# EAGLE design USBRALite14a (EAGLE 6.6.0)
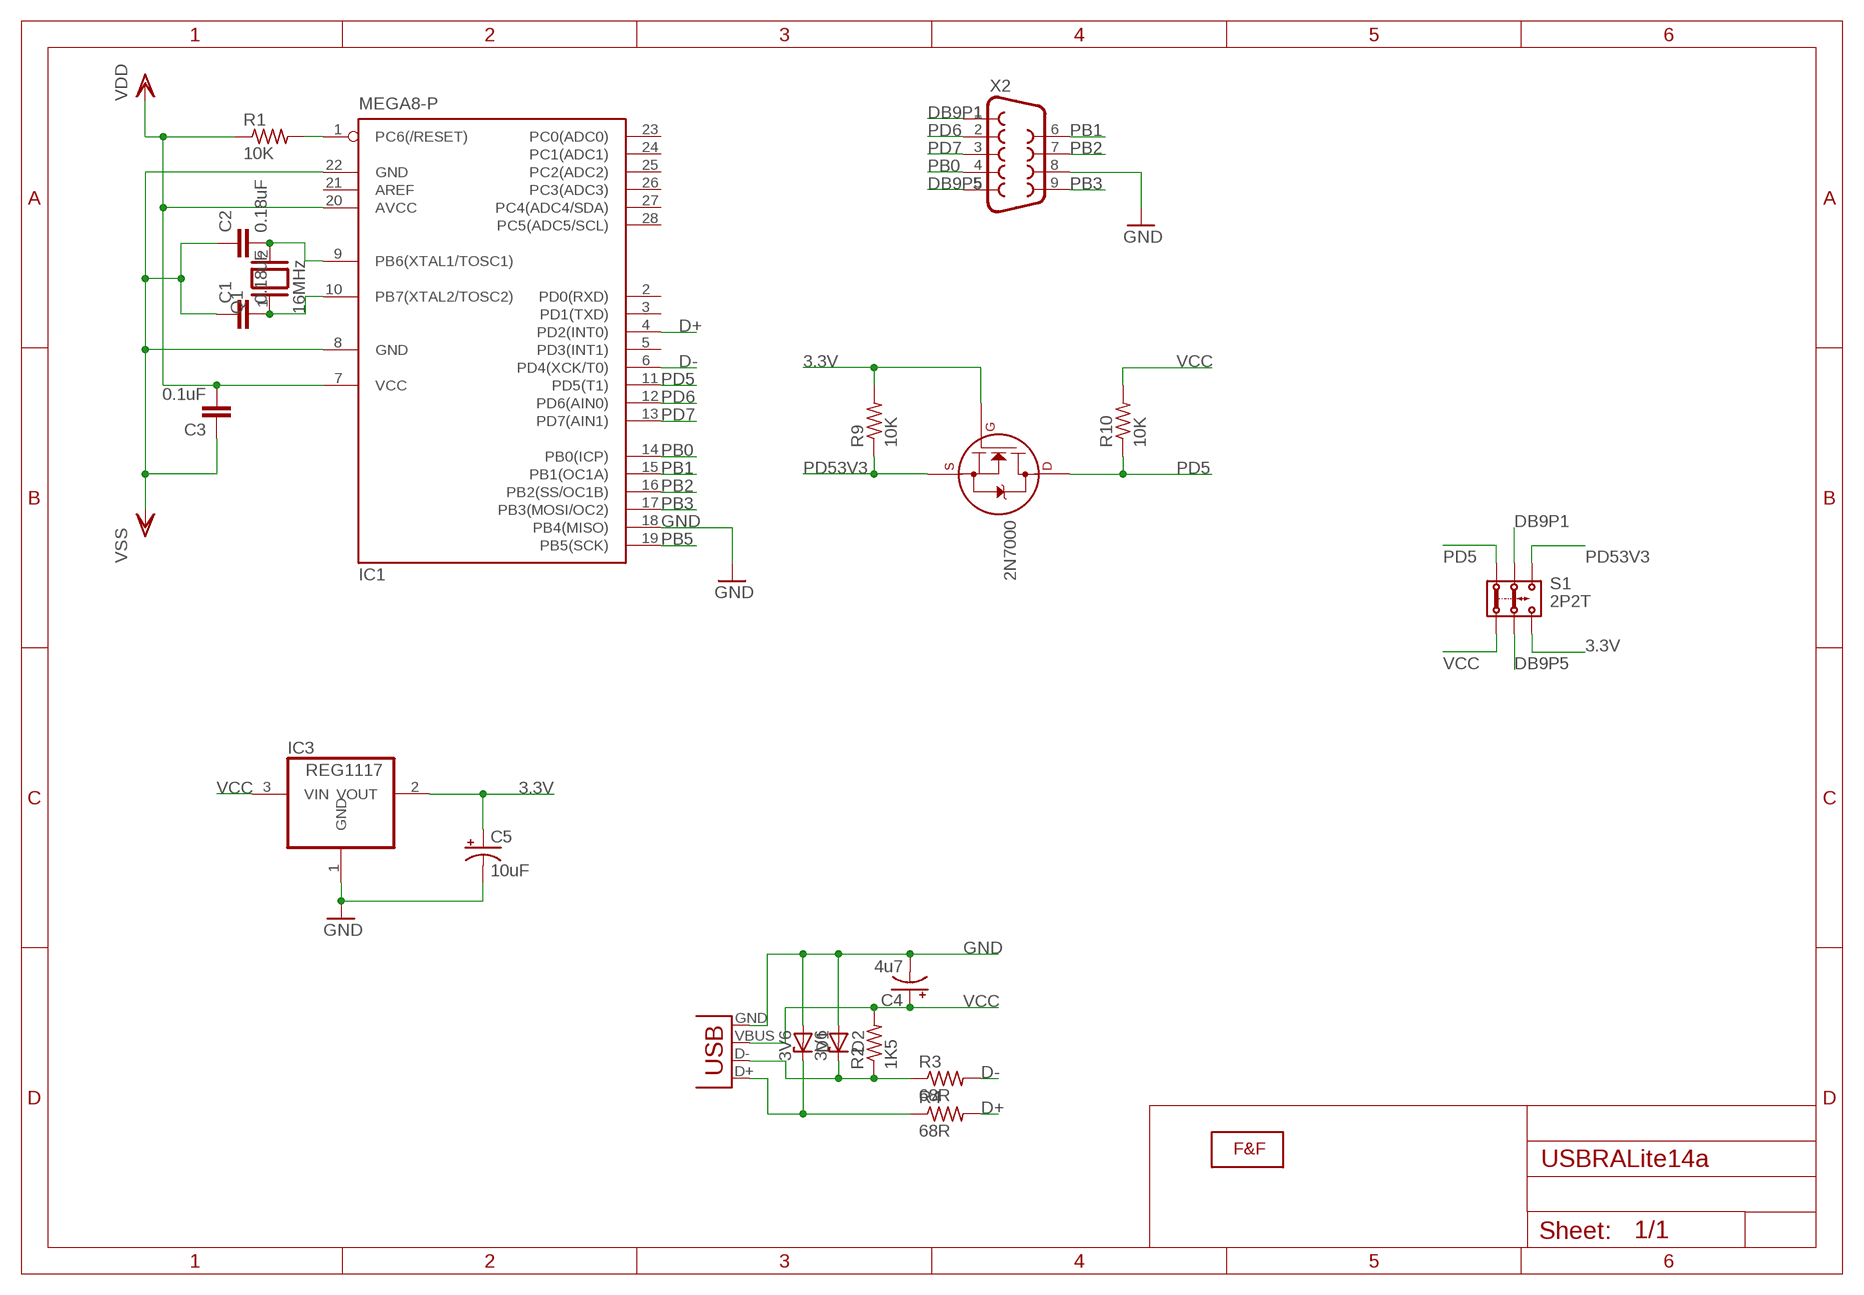
[diagram p0: schematic, sheet 1]

## Parts
2N7000  2N7000_TO92  [TO-92]
C1  0.18uF  C-EU050-024X044  [C050-024X044]
C2  0.18uF  C-EU050-024X044  [C050-024X044]
C3  0.1uF  C-EU050-024X044  [C050-024X044]
C4  4u7  CPOL-USE2.5-6  [E2,5-6]
C5  10uF  CPOL-USE2.5-6  [E2,5-6]
D1  3V6  ZENER-DIODEZD-5  [ZDIO-5]
D2  3V6  ZENER-DIODEZD-5  [ZDIO-5]
IC1  MEGA8-P  [DIL28-3]
IC3  REG1117  [SOT223]
Q1  16MHz  XTAL/S  [QS]
R1  10K  R-US_0207/10  [0207/10]
R2  1K5  R-US_0207/10  [0207/10]
R3  68R  R-US_0207/10  [0207/10]
R4  68R  R-US_0207/10  [0207/10]
R9  10K  R-US_0207/10  [0207/10]
R10  10K  R-US_0207/10  [0207/10]
S1  2P2T  [2P2T]
U$1  LOGOLOGO_WITHOUT_SMOKE_SMALL  [LOGO2_SMALL]
X1  USBPTH  [USB-B-PTH]
X2  DB9MALE  [DB9_MALE]

## Nets
3.3V: 2N7000.2(G) C5.+ IC3.2(VOUT) R9.2 S1.3.2
D+: IC1.4(PD2(INT0)) R4.2
D-: IC1.6(PD4(XCK/T0)) R3.2
DB9P1: S1.2.1 X2.1
DB9P5: S1.2.2 X2.5
GND: C1.1 C2.1 C3.1 C4.- C5.- D1.A D2.A IC1.8(GND) IC1.18(PB4(MISO)) IC1.22(GND) IC3.1(GND) X1.GND X2.8 ; supply symbol labelled VSS
N$1: IC1.1(PC6(/RESET)) R1.2
N$2: C2.2 IC1.9(PB6(XTAL1/TOSC1)) Q1.2
N$3: C1.2 IC1.10(PB7(XTAL2/TOSC2)) Q1.1
N$8: D1.C R4.1 X1.D+
N$9: D2.C R2.1 R3.1 X1.D-
PB0: IC1.14(PB0(ICP)) X2.4
PB1: IC1.15(PB1(OC1A)) X2.6
PB2: IC1.16(PB2(SS/OC1B)) X2.7
PB3: IC1.17(PB3(MOSI/OC2)) X2.9
PB5: IC1.19(PB5(SCK))
PD5: 2N7000.3(D) IC1.11(PD5(T1)) R10.1 S1.1.1
PD6: IC1.12(PD6(AIN0)) X2.2
PD7: IC1.13(PD7(AIN1)) X2.3
PD53V3: 2N7000.1(S) R9.1 S1.3.1
VCC: C3.2 C4.+ IC1.7(VCC) IC1.20(AVCC) IC3.3(VIN) R1.1 R2.2 R10.2 S1.1.2 X1.VBUS ; supply symbol labelled VDD
Unconnected: IC1.2(PD0(RXD)) IC1.3(PD1(TXD)) IC1.5(PD3(INT1)) IC1.21(AREF) IC1.23(PC0(ADC0)) IC1.24(PC1(ADC1)) IC1.25(PC2(ADC2)) IC1.26(PC3(ADC3)) IC1.27(PC4(ADC4/SDA)) IC1.28(PC5(ADC5/SCL))

## Library data of the parts
2N7000 = transistors:2N700*: 2N7000, 2N7002, NDS7002A N-channel enhancement mode MOSFET
C1-C3 = rcl:C-EU: CAPACITOR, European symbol
C4 = adafruit:CPOL-US: POLARIZED CAPACITOR, American symbol
C5 = rcl:CPOL-US: POLARIZED CAPACITOR, American symbol
D1 D2 = diode:ZENER-DIODE: Z-Diode
IC1 = atmel:MEGA8-P: MICROCONTROLLER 8 Kbytes FLASH, 1 kbytes SRAM, 512 bytes EEPROM, USART, 4-channel 10 bit ADC, 2-channel 8 bit ADC Pin compatible with Atmega48, ATMega88, ATMega168 Source: avr.lbr; OC_FARNELL: unknown; OC_NEWARK: unknown
IC3 = burr-brown:REG1117: 800mA and 1A Low Dropout (LDO) Positive Regulator 1.8V, 2.5V, 2.85V, 3.3V, 5V, and Adj; MPN: REG1117; OC_FARNELL: 1097566; OC_NEWARK: 14P6981
Q1 = special:XTAL/S: CRYSTAL
R1-R4 R9 R10 = adafruit:R-US_: RESISTOR, American symbol
S1 = Itead_BP_110825:2P2T: BAS011
U$1 = F&F:LOGO: Faísca e Fumaça Logo faiscaefumaca.com.br
X1 = SparkFun:USB: USB Connectors USB-B-PTH is fully proven SKU : PRT-00139 USB-miniB is fully proven SKU : PRT-00587 USB-A-PCB is untested. USB-A-H is throughly reviewed, but untested. Spark Fun Electronics SKU : PRT-00437 USB-B-SMT is throughly reviewed, but untested. Needs silkscreen touching up. USB-A-S has not been used/tested USB-MB-H has not been used/tested
X2 = SparkFun:DB9: DB9 Connector Standard DB9 (D-Sub 9) serial connector. Can be used for CAN bus as well as RS485 and RS232. Footprint production proven. Spark Fun Electronics SKU : PRT-00429

## Board
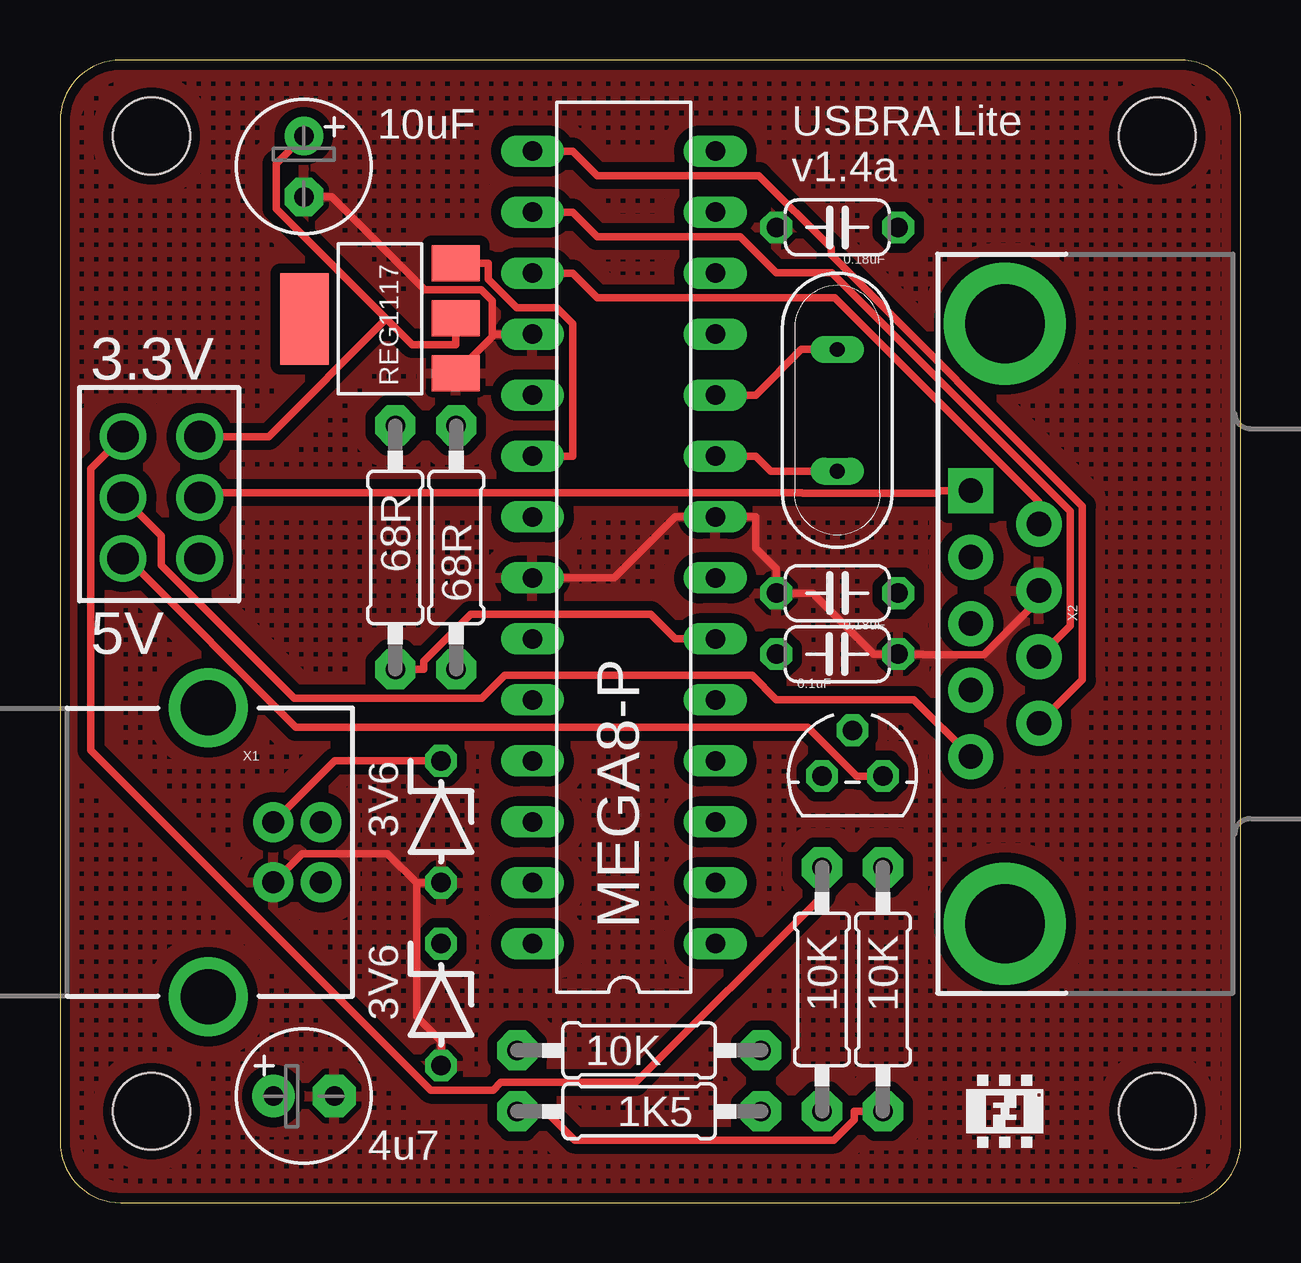
[diagram p1: board, top side]
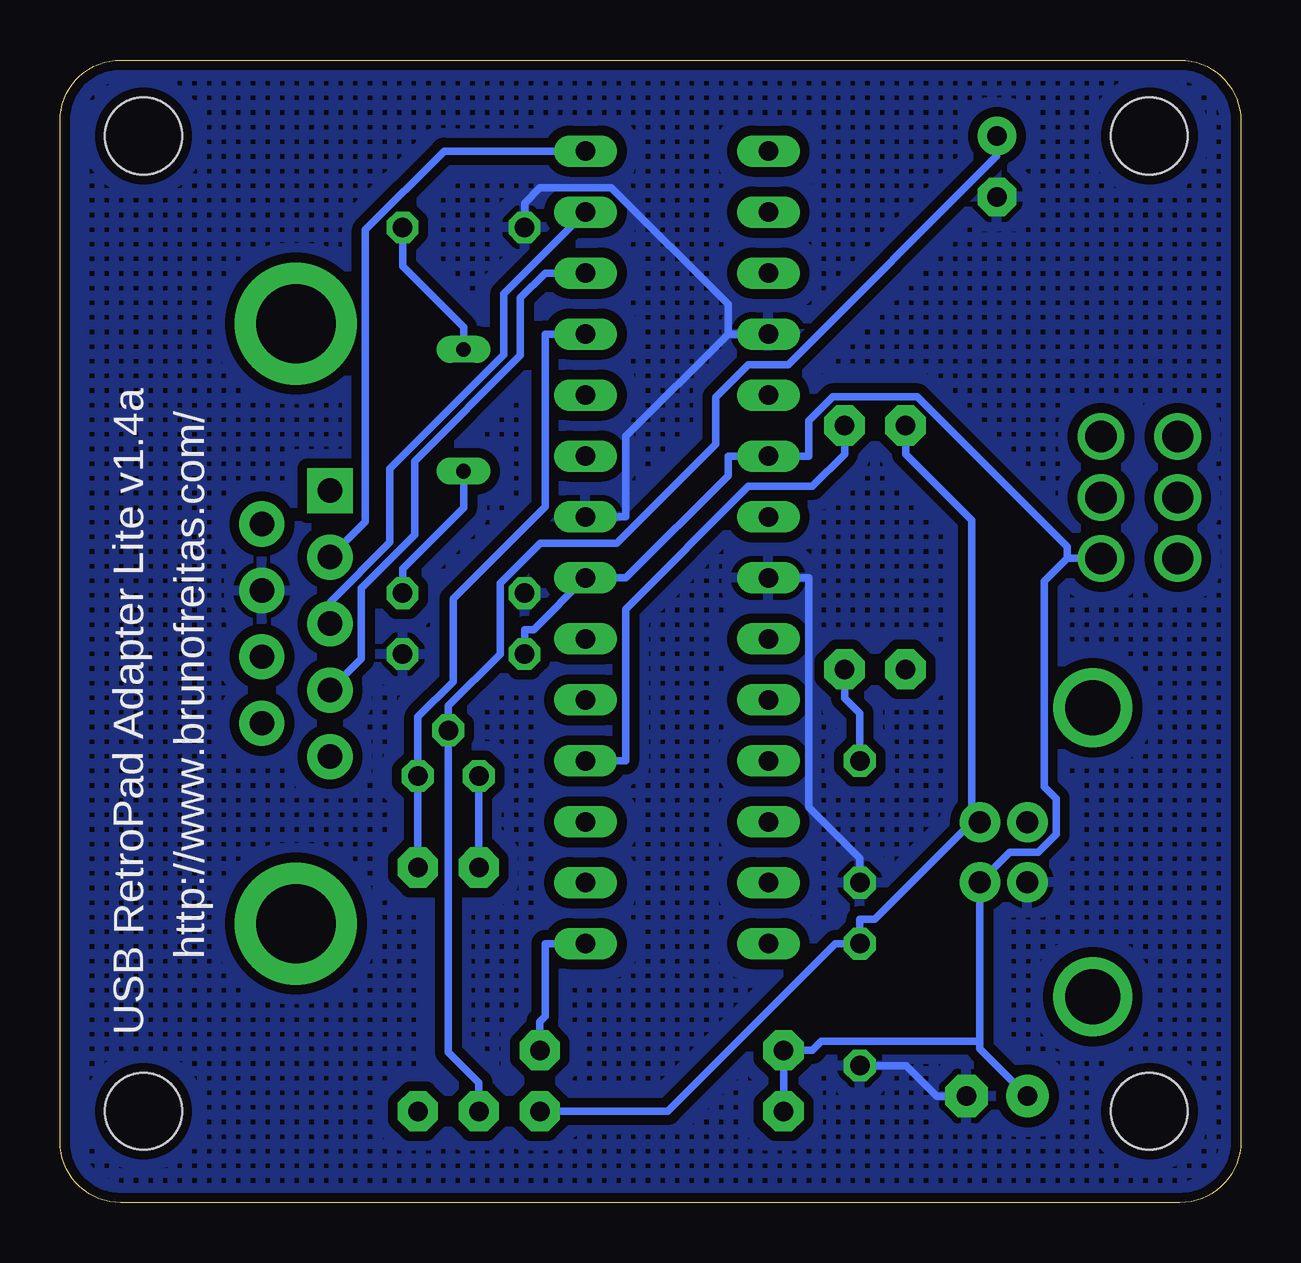
[diagram p2: board, bottom side, seen from below]

Size 49.2 x 47.62 mm. Coordinates in mm from the lower left corner, seen from the top.
Outline: 49.2,45.08 arc90 46.66,47.62 2.54,47.62 arc90 0,45.08 0,2.54 arc90 2.54,0 46.66,0 arc90 49.2,2.54 49.2,45.08
Copper layers (1*16): Top 0.035mm / dielectric 1.5mm / Bottom 0.035mm
Design rules "SeeedStudio_2layer_DRU_no_angle_20140221": minimum track width 6mil, minimum drill 12mil, track to track 6mil, track to pad 6mil, pad to pad 6mil, via to via 6mil, smd to smd 0mil, copper to edge 10mil, drill to drill 10mil, minimum pad ring 10mil, minimum via ring 6mil, stop-mask expansion 2mil, vias tented up to drill 100mil, thermal gap 10mil
Holes 3.2 mm at 3.81,44.45 3.81,3.81 45.72,44.45 45.72,3.81

### Footprints (pad centres in the part's own frame; a part is rotated, then mirrored left to right if it is on the bottom)
TO-92 = drill 0.813 octagon: 1 -1.27,0; 2 0,1.905; 3 1.27,0
C050-024X044 = drill 0.813 octagon: 1 -2.54,0; 2 2.54,0
E2,5-6 = drill 0.813 pad 1.778: + -1.27,0 | drill 0.813 pad 1.778 octagon: - 1.27,0
E2,5-6' = drill 0.813 pad 1.6: + -1.27,0 | drill 0.813 pad 1.6 octagon: - 1.27,0
ZDIO-5 = drill 0.813 octagon: A 2.54,0; C -2.54,0
DIL28-3 = drill 0.813 long: 1 -16.51,-3.81; 2 -13.97,-3.81; 3 -11.43,-3.81; 4 -8.89,-3.81; 5 -6.35,-3.81; 6 -3.81,-3.81; 7 -1.27,-3.81; 8 1.27,-3.81; 9 3.81,-3.81; 10 6.35,-3.81; 11 8.89,-3.81; 12 11.43,-3.81; 13 13.97,-3.81; 14 16.51,-3.81; 15 16.51,3.81; 16 13.97,3.81; 17 11.43,3.81; 18 8.89,3.81; 19 6.35,3.81; 20 3.81,3.81; 21 1.27,3.81; 22 -1.27,3.81; 23 -3.81,3.81; 24 -6.35,3.81; 25 -8.89,3.81; 26 -11.43,3.81; 27 -13.97,3.81; 28 -16.51,3.81
SOT223 = smd 1.499 x 2.007: 1 -2.261,-3.15; 2 0.025,-3.15; 3 2.311,-3.15 | smd 3.81 x 2.007: 4 0,3.15
QS = drill 0.61 long: 1 -2.54,0; 2 2.54,0
0207/10 = drill 0.813 pad 1.676 octagon: 1 -5.08,0; 2 5.08,0
2P2T = drill 1.3 pad 1.93: 1.1 -3.635,-0.085; 1.2 -3.635,-3.285; 2.1 -1.095,-0.085; 2.2 -1.095,-3.285; 3.1 1.445,-0.085; 3.2 1.445,-3.285
USB-B-PTH = drill 0.914 pad 1.676: D+ 0,1.25; D- 1.981,1.25; GND 0,-1.25; VBUS 1.981,-1.25 | drill 2.286: S1 -2.718,-6.02; S2 -2.718,6.02
DB9_MALE = drill 1.016 pad 1.88: 1 5.54,-1.42; 2 2.77,-1.42; 3 0,-1.42; 4 -2.77,-1.42; 6 4.15,1.42; 7 1.38,1.42; 8 -1.38,1.42; 9 -4.15,1.42 | drill 1.016 pad 1.88 square: 5 -5.54,-1.42 | drill 3.302 pad 5.08: G1 -12.5,0; G2 12.5,0

### Placement (x,y rotation side)
2N7000  33.02,17.78 0 top
C1  32.38,40.64 0 top
C2  32.38,25.4 0 top
C3  32.38,22.86 180 top
C4  10.16,4.45 0 top
C5  10uF  [E2,5-6']  10.16,43.18 270 top
D1  15.88,15.88 270 top
D2  15.88,8.26 270 top
IC1  23.5,27.3 90 top
IC3  13.34,36.83 90 top
Q1  32.38,33.02 270 top
R1  24.13,6.35 0 top
R2  24.13,3.81 180 top
R3  13.97,27.3 270 top
R4  16.51,27.3 90 top
R9  31.75,8.89 270 top
R10  34.29,8.89 270 top
S1  2.54,30.48 90 top
U$1  39.37,3.81 0 top
X1  8.89,14.61 0 top
X2  39.37,24.13 270 top

### Tracks (layer width: path | path; a pad name or v marks a point on that pad's centre or on a via)
3.3V
  Top 0.152: S1.3.2 5.89,31.9 5.89,31.93
  Top 0.305: 13.6,36.83 8.69,31.93 5.89,31.93 S1.3.2 | 13.6,36.83 9,41.43 9,43.29 C5.+ | 13.6,36.83 14.68,35.75 16.48,35.75 IC3.2
  Bottom 0.305: C5.+ 10.16,43.62 18.86,34.92 20.52,34.92 21.87,33.57 21.87,31.61 26,27.48 29.2,27.48 30.86,25.82 30.86,22.86 33.02,20.7 2N7000.2 33.02,6.27 31.75,5 R9.2
D+
  Bottom 0.305: IC1.4 25.63,18.41 25.63,24.73 20.51,29.84 17.86,29.84 16.51,31.19 R4.2
D-
  Top 0.305: IC1.6 25.63,23.5 24.61,24.51 17.11,24.51 15.16,22.57 15.16,22.23 R3.2
DB9P1
  Top 0.152: X2.1 38,18.69 37.92,18.62 | 2.69,29.31 2.64,29.26 S1.2.1
  Top 0.305: X2.1 37.92,18.62 35.57,20.97 29.85,20.97 28.84,21.97 18.53,21.97 17.58,21.03 9.75,21.03 4.22,26.56 4.22,27.79 2.69,29.31 S1.2.1
DB9P5
  Top 0.152: 5.9,29.46 5.89,29.46 S1.2.2 | 38,29.67 X2.5 38,29.67
  Top 0.305: X2.5 36.66,29.67 36.55,29.57 30.94,29.57 30.91,29.59 6.03,29.59 5.9,29.46 S1.2.2
GND
  Top 0.305: X2.8 40.79,25.13 38.49,22.83 35.97,22.83 35.94,22.86 C3.1 33.91,22.86 31.37,25.4 C2.1 29.84,26.42 28.98,27.28 28.98,28.57 IC1.8 26.9,28.57 25.63,28.57 23.09,26.04 IC1.22 | D2.A 15.88,6.73 14.86,7.75 14.86,13.34 | 14.86,13.34 14.99,13.34 D1.A | 14.86,13.34 13.64,14.55 10.09,14.55 X1.GND | C5.- 11.32,41.91 15.19,38.04 17.56,38.04 18.01,37.59 18.01,36.2 | IC1.18 18.01,36.2 | IC3.1 18.01,36.09 18.01,36.2
  Bottom 0.305: C4.- 12.68,4.45 13.95,5.71 D2.A | C1.1 29.84,41.66 29.21,42.3 26.23,42.3 21.36,37.43 21.36,36.2 | 21.36,36.2 25.63,31.93 25.63,28.57 IC1.8 | IC1.18 21.36,36.2 | IC1.22 18.01,26.04 18.01,16.48 15.88,14.35 D1.A
  pour Bottom (isolate 0.406, hatched): 0,48.26 49.53,48.26 49.53,0 0,0
  pour Top (isolate 0.406, hatched): 0,48.26 49.53,48.26 49.53,0 0,0
N$1
  Bottom 0.305: IC1.1 28.98,10.79 28.98,7.77 29.21,7.54 R1.2
N$2
  Top 0.305: IC1.9 28.98,31.11 29.62,30.48 Q1.2
  Bottom 0.305: C2.2 34.92,26.42 32.38,28.96 Q1.2
N$3
  Top 0.305: IC1.10 28.98,33.66 30.89,35.56 Q1.1
  Bottom 0.305: Q1.1 32.38,36.47 34.92,39.01 C1.2
N$8
  Top 0.152: X1.D+ 8.94,15.85 8.91,15.88
  Top 0.305: X1.D+ 8.91,15.88 11.45,18.41 D1.C
  Bottom 0.305: R4.1 16.51,21.03 15.88,20.4 D1.C
N$9
  Bottom 0.152: X1.D- 10.97,15.85 10.97,15.86
  Bottom 0.305: 11.21,15.86 11.21,28.43 13.97,31.19 R3.1 | 11.21,15.86 15.26,11.81 15.88,11.81 D2.C 16.89,10.79 23.88,3.81 28.02,3.81 R2.1 | X1.D- 10.97,15.86 11.21,15.86
PB0
  Bottom 0.152: X2.4 38,27.03 37.91,26.94
  Bottom 0.305: X2.4 37.91,26.94 36.47,28.38 36.47,40.53 33.19,43.81 IC1.14
PB1
  Top 0.152: X2.6 40.84,20.12 40.88,20.07
  Top 0.305: IC1.15 21.36,43.81 22.38,42.8 29.12,42.8 32.13,39.79 32.13,39.49 42.6,29.02 42.6,21.79 40.88,20.07 X2.6
PB2
  Top 0.152: X2.7 40.84,22.76 40.82,22.78
  Top 0.305: IC1.16 21.36,41.27 22.38,40.26 28.33,40.26 29.85,38.75 32.16,38.75 42.09,28.82 42.09,24.05 40.82,22.78 X2.7
PB3
  Top 0.152: X2.9 40.84,28.45 40.79,28.45
  Top 0.305: IC1.17 21.36,38.73 22.38,37.72 32.29,37.72 40.79,29.21 40.79,28.45 X2.9
PD5
  Top 0.152: S1.1.1 2.64,26.82 2.64,26.84
  Top 0.305: S1.1.1 2.64,26.84 2.79,26.84 9.83,19.81 31.16,19.81 33.19,17.78 2N7000.3
  Bottom 0.305: IC1.11 28.98,36.2 28.98,29 32.82,25.16 32.82,21.71 34.29,20.24 2N7000.3 R10.1
PD6
  Bottom 0.152: 38,21.34 X2.2 38,21.34
  Bottom 0.305: X2.2 36.65,22.66 36.65,25.6 34.42,27.84 34.42,30.9 30.01,35.31 30.01,37.7 28.98,38.73 IC1.12
PD7
  Bottom 0.152: X2.3 38,24.18 37.95,24.18
  Bottom 0.305: X2.3 37.95,24.18 37.95,25.02 35.46,27.51 35.46,30.58 30.7,35.34 30.7,37.88 IC1.13
PD53V3
  Top 0.152: S1.3.1 2.64,31.9 S1.3.1
  Top 0.305: R9.1 31.75,12.78 23.99,5.01 18.37,5.01 18.06,4.7 15.45,4.7 1.29,18.86 1.29,30.59 S1.3.1 | S1.3.1
  Bottom 0.305: R9.1 2N7000.1
VCC
  Top 0.305: R10.2 33.1,3.81 33.1,3.46 32.25,2.61 21.44,2.61 20.24,3.81 R2.2 | IC3.3 17.84,39.14 17.84,38.48 19.03,37.28 20.69,37.28 21.36,36.62 21.36,31.11 IC1.20
  Bottom 0.152: 5.89,26.84 5.89,26.82 S1.1.2 | 10.97,13.41 X1.VBUS 10.97,13.41
  Bottom 0.305: 7.22,26.84 7.22,27.33 13.48,33.58 17,33.58 18.01,32.58 18.01,31.11 IC1.20 21.36,31.11 21.36,30.3 25.63,26.04 IC1.7 29.46,23.88 29.84,23.88 C3.2 | 7.22,26.84 8.18,25.89 8.18,17.33 7.7,16.84 7.7,15.35 8.44,14.61 9.62,14.61 X1.VBUS 10.87,6.73 | S1.1.2 5.89,26.84 7.22,26.84 | 10.87,6.73 10.87,6.43 C4.+ | 10.87,6.73 17.47,6.73 17.86,6.35 R1.1 R2.2

### Text on the board
tPlace: USBRA Lite | v1.4a | 3.3V | 5V
bPlace: http://www.brunofreitas.com/ | USB RetroPad Adapter Lite v1.4a